# Altium schematic sheet PWR.SchDoc
size A4
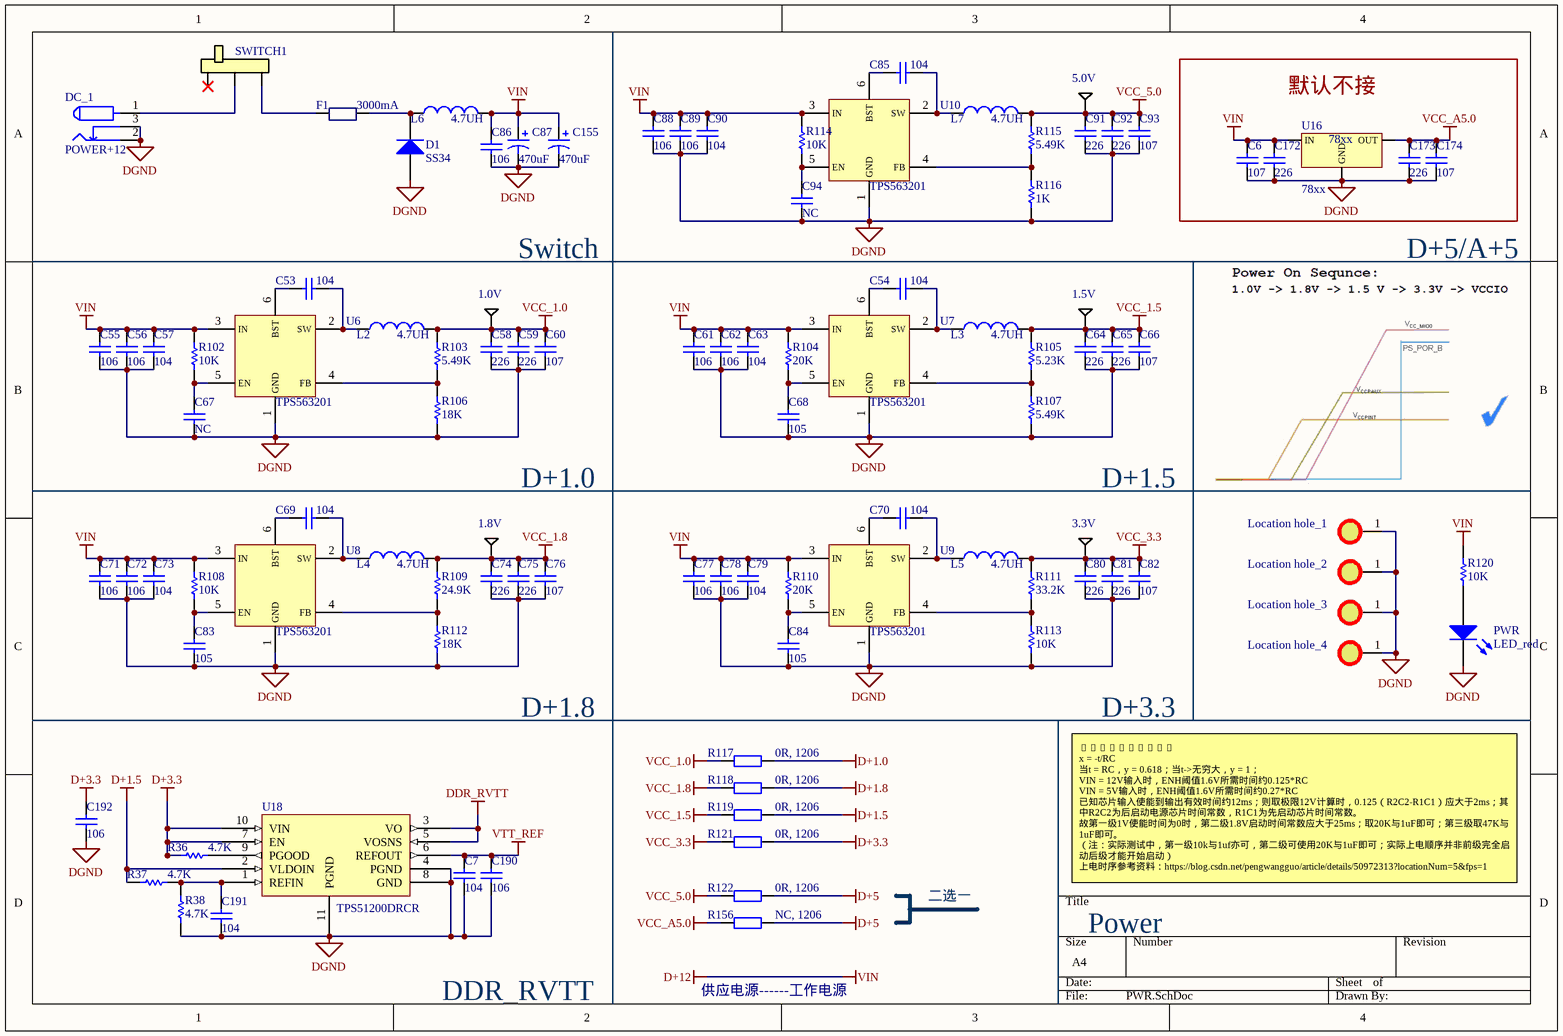
[diagram p0: PWR.SchDoc]

## Parts
1.0V  Test  [Test Point]  (value not drawn)
1.5V  Test  [Test Point]  (value not drawn)
1.8V  Test  [Test Point]  (value not drawn)
3.3V  Test  [Test Point]  (value not drawn)
5.0V  Test  [Test Point]  (value not drawn)
C6  107  [C 1206_L]
C7  104  [C 0402_LL]
C53  104  [C 0402_LL]
C54  104  [C 0402_LL]
C55  106  [C 0805_L]
C56  106  [C 0805_L]
C57  104  [C 0402_LL]
C58  226  [C 0805_L]
C59  226  [C 0805_L]
C60  107  [C 1206_L]
C61  106  [C 0805_L]
C62  106  [C 0805_L]
C63  104  [C 0402_LL]
C64  226  [C 0805_L]
C65  226  [C 0805_L]
C66  107  [C 1206_L]
C67  NC  [C 0402_LL]
C68  105  [C 0402_LL]
C69  104  [C 0402_LL]
C70  104  [C 0402_LL]
C71  106  [C 0805_L]
C72  106  [C 0805_L]
C73  104  [C 0402_LL]
C74  226  [C 0805_L]
C75  226  [C 0805_L]
C76  107  [C 1206_L]
C77  106  [C 0805_L]
C78  106  [C 0805_L]
C79  104  [C 0402_LL]
C80  226  [C 0805_L]
C81  226  [C 0805_L]
C82  107  [C 1206_L]
C83  105  [C 0402_LL]
C84  105  [C 0402_LL]
C85  104  [C 0402_LL]
C86  106  [C 0805_L]
C87  value 470uF  [CD D(7343)]  (hidden comment: Cap Pol1)
C88  106  [C 0805_L]
C89  106  [C 0805_L]
C90  104  [C 0402_LL]
C91  226  [C 0805_L]
C92  226  [C 0805_L]
C93  107  [C 1206_L]
C94  NC  [C 0402_LL]
C155  value 470uF  [CD D(7343)]  (hidden comment: Cap Pol1)
C172  226  [C 0805_L]
C173  226  [C 0805_L]
C174  107  [C 1206_L]
C190  106  [C 0603_L]
C191  104  [C 0402_LL]
C192  106  [C 0603_L]
D1  SS34  [SMA]
DC_1  POWER+12  [DC-005]
F1  3000mA  [FU 1812]
L2  value 4.7UH  [NR6045]  (hidden comment: Inductor)
L3  value 4.7UH  [NR6045]  (hidden comment: Inductor)
L4  value 4.7UH  [NR6045]  (hidden comment: Inductor)
L5  value 4.7UH  [NR6045]  (hidden comment: Inductor)
L6  value 4.7UH  [NR6045]  (hidden comment: Inductor)
L7  value 4.7UH  [NR6045]  (hidden comment: Inductor)
Location_hole_1  Touch  [M3x4+6_N]  (value not drawn)
Location_hole_2  Touch  [M3x4+6_N]  (value not drawn)
Location_hole_3  Touch  [M3x4+6_N]  (value not drawn)
Location_hole_4  Touch  [M3x4+6_N]  (value not drawn)
PWR  LED_red  [LED 0603W]
R36  4.7K  [R 0402_L]
R37  4.7K  [R 0402_L]
R38  4.7K  [R 0402_L]
R102  10K  [R 0603_L]
R103  5.49K  [R 0603_L]
R104  20K  [R 0603_L]
R105  5.23K  [R 0603_L]
R106  18K  [R 0603_L]
R107  5.49K  [R 0603_L]
R108  10K  [R 0603_L]
R109  24.9K  [R 0603_L]
R110  20K  [R 0603_L]
R111  33.2K  [R 0603_L]
R112  18K  [R 0603_L]
R113  10K  [R 0603_L]
R114  10K  [R 0603_L]
R115  5.49K  [R 0603_L]
R116  1K  [R 0603_L]
R117  0R, 1206  [R 1206_L]
R118  0R, 1206  [R 1206_L]
R119  0R, 1206  [R 1206_L]
R120  10K  [R 0603_L]
R121  0R, 1206  [R 1206_L]
R122  0R, 1206  [R 1206_L]
R156  NC, 1206  [R 1206_L]
SWITCH1  Switch  [SS-12D10]  (value not drawn)
U6  TPS563201  [SOT23-6N]
U7  TPS563201  [SOT23-6N]
U8  TPS563201  [SOT23-6N]
U9  TPS563201  [SOT23-6N]
U10  TPS563201  [SOT23-6N]
U16  78xx  [TO252]
U18  TPS51200DRCR  [VSON]

## Blocks framed on the sheet
默认不接: C6 C172-C174 U16

## Nets
D+1.0: R117.2
D+1.5: R37.1 R119.2 U18.2(VLDOIN)
D+1.8: R118.2
D+3.3: C192.2 R36.1 R121.2 U18.7(EN) U18.10(VIN)
D+5: R122.2 R156.2
D+12: C6.1 C55.1 C56.1 C57.1 C61.1 C62.1 C63.1 C71.1 C72.1 C73.1 C77.1 C78.1 C79.1 C86.1 C87.1 C88.1 C89.1 C90.1 C155.1 C172.1 L6.2 R102.2 R104.2 R108.2 R110.2 R114.1 R120.2 U6.3(IN) U7.3(IN) U8.3(IN) U9.3(IN) U10.3(IN) U16.1(IN)  [also labelled VIN]
DDR_RVTT: U18.3(VO) U18.5(VOSNS)
DGND: C6.2 C7.1 C55.2 C56.2 C57.2 C58.2 C59.2 C60.2 C61.2 C62.2 C63.2 C64.2 C65.2 C66.2 C67.2 C68.2 C71.2 C72.2 C73.2 C74.2 C75.2 C76.2 C77.2 C78.2 C79.2 C80.2 C81.2 C82.2 C83.2 C84.2 C86.2 C87.2 C88.2 C89.2 C90.2 C91.2 C92.2 C93.2 C94.2 C155.2 C172.2 C173.2 C174.2 C190.1 C191.1 C192.1 D1.1(A) DC_1.2 DC_1.3 Location_hole_1.1 Location_hole_2.1 Location_hole_3.1 Location_hole_4.1 PWR.2(K) R38.1 R106.1 R107.1 R112.1 R113.1 R116.1 U6.1(GND) U7.1(GND) U8.1(GND) U9.1(GND) U10.1(GND) U16.2(GND) U18.4(PGND) U18.8(GND) U18.11(PGND)
VCC_1.0: 1.0V.1(Test) C58.1 C59.1 C60.1 L2.2 R103.2 R117.1
VCC_1.5: 1.5V.1(Test) C64.1 C65.1 C66.1 L3.2 R105.2 R119.1
VCC_1.8: 1.8V.1(Test) C74.1 C75.1 C76.1 L4.2 R109.2 R118.1
VCC_3.3: 3.3V.1(Test) C80.1 C81.1 C82.1 L5.2 R111.2 R121.1
VCC_5.0: 5.0V.1(Test) C91.1 C92.1 C93.1 L7.2 R115.2 R122.1
VCC_A5.0: C173.1 C174.1 R156.1 U16.3(OUT)
VTT_REF: C7.2 C190.2 U18.6(REFOUT)
NetC53_1: C53.1 L2.1 U6.2(SW)
NetC53_2: C53.2 U6.6(BST)
NetC54_1: C54.1 L3.1 U7.2(SW)
NetC54_2: C54.2 U7.6(BST)
NetC67_1: C67.1 R102.1 U6.5(EN)
NetC68_1: C68.1 R104.1 U7.5(EN)
NetC69_1: C69.1 L4.1 U8.2(SW)
NetC69_2: C69.2 U8.6(BST)
NetC70_1: C70.1 L5.1 U9.2(SW)
NetC70_2: C70.2 U9.6(BST)
NetC83_1: C83.1 R108.1 U8.5(EN)
NetC84_1: C84.1 R110.1 U9.5(EN)
NetC85_1: C85.1 L7.1 U10.2(SW)
NetC85_2: C85.2 U10.6(BST)
NetC94_1: C94.1 R114.2 U10.5(EN)
NetC191_2: C191.2 R37.2 R38.2 U18.1(REFIN)
NetD1_2: D1.2(K) F1.1 L6.1
NetDC_1_1: DC_1.1 SWITCH1.2
NetF1_2: F1.2 SWITCH1.3
NetPWR_1: PWR.1(A) R120.1
NetR36_2: R36.2 U18.9(PGOOD)
NetR103_1: R103.1 R106.2 U6.4(FB)
NetR105_1: R105.1 R107.2 U7.4(FB)
NetR109_1: R109.1 R112.2 U8.4(FB)
NetR111_1: R111.1 R113.2 U9.4(FB)
NetR115_1: R115.1 R116.2 U10.4(FB)

Not connected (* = marked no-connect by the designer): SWITCH1 1*

## Notes on the sheet
- Switch
- D+5/A+5
- D+1.0
- D+1.5
- D+1.8
- D+3.3
- Vref = 0.768V
  1.0V : (R1+Rf)/Rf = 1.309(5.49K; 18K)
  1.5V : (R1+Rf)/Rf = 1.953(5.23K; 5.49K)
  1.8V : (R1+Rf)/Rf = 2.37(24.9K; 18K)
  3.3V : (R1+Rf)/Rf = 4.32(33.2K; 10K)
- 二选一
- 𝑦=1−𝑒^(−𝑥)
  x = -t/RC
  当t = RC，y = 0.618；当t->无穷大，y = 1；
  VIN = 12V输入时，ENH阈值1.6V所需时间约0.125*RC
  VIN = 5V输入时，ENH阈值1.6V所需时间约0.27*RC
  已知芯片输入使能到输出有效时间约12ms；则取极限12V计算时，0.125（R2C2-R1C1）应大于2ms；其中R2C2为后启动电源芯片时间常数，R1C1为先启动芯片时间常数。
  故第一级1V使能时间为0时，第二级1.8V启动时间常数应大于25ms；取20K与1uF即可；第三级取47K与1uF即可。
  （注：实际测试中，第一级10k与1uf亦可，第二级可使用20K与1uF即可；实际上电顺序并非前级完全启动后级才能开始启动）
  上电时序参考资料：https://blog.csdn.net/pengwangguo/article/details/50972313?locationNum=5&fps=1
- Power
- DDR_RVTT
- 供应电源------工作电源

## Library data of the parts
1.0V 1.5V 1.8V 3.3V 5.0V = Test: Test Point
C6 C7 C53-C86 C88-C94 C172-C174 C190-C192 = Cap: Capacitor; Published: 8-Jun-2000; LatestRevisionDate: 17-Jul-2002; LatestRevisionNote: Re-released for DXP Platform.; PackageReference: RAD-0.3; Publisher: Altium Limited; PackageDescription: Radial Cap, Thru-Hole; 2 Leads; 0.3 in Pin Spacing
C87 C155 = Cap Pol1: Polarized Capacitor (Radial); Published: 8-Jun-2000; LatestRevisionDate: 17-Jul-2002; LatestRevisionNote: Re-released for DXP Platform.; PackageReference: RB7.6-15; Publisher: Altium Limited; PackageDescription: Polarized Capacitor (Radial); 2 Leads
D1 = Diode: Default Diode; Published: 8-Jun-2000; LatestRevisionDate: 17-Jul-2002; LatestRevisionNote: Re-released for DXP Platform.; PackageVersion: Sep-1996; PackageReference: SMC; Publisher: Altium Limited; PackageDescription: DO-214-AB/SMC; 2 C-Bend Leads; Body 7.9 x 5.9 mm, inc. leads (LxW); Code_JEDEC: DO-214-AB
DC_1 = POWER
F1 = PTC
L2-L7 = Inductor: Code_IEC: 1005; Published: 8-Jun-2000; LatestRevisionDate: 29-May-2009; LatestRevisionNote: IPC-7351 Footprint Added.; PackageReference: 0402-A; Publisher: Altium Limited; PackageDescription: Chip Inductor; Code_JEITA: 0402
PWR = LED0: Typical INFRARED GaAs LED; Published: 8-Jun-2000; LatestRevisionDate: 08-Jul-2005; LatestRevisionNote: Mech Layer 1 removed.; PackageReference: LED-0; Publisher: Altium Limited; PackageDescription: LED; 2 Leads
R36-R38 R102-R115 R120 = Res1: Resistor; Value: 1K; Published: 8-Jun-2000; LatestRevisionDate: 17-Jul-2002; LatestRevisionNote: Re-released for DXP Platform.; PackageReference: AXIAL-0.3; Publisher: Altium Limited; PackageDescription: Axial Device, Thru-Hole; 2 Leads; 0.3 in Pin Spacing
R116 = Res1: Resistor; Published: 8-Jun-2000; LatestRevisionDate: 17-Jul-2002; LatestRevisionNote: Re-released for DXP Platform.; PackageReference: AXIAL-0.3; Publisher: Altium Limited; PackageDescription: Axial Device, Thru-Hole; 2 Leads; 0.3 in Pin Spacing; Value: 1K
R117-R119 R121 R122 R156 = Res2: Resistor; Value: RES; Published: 8-Jun-2000; LatestRevisionDate: 17-Jul-2002; LatestRevisionNote: Re-released for DXP Platform.; PackageReference: AXIAL-0.4; Publisher: Altium Limited; PackageDescription: Axial Device, Thru-Hole; 2 Leads; 0.4 in Pin Spacing
U6-U10 = TPS563201: TPS563201, BUCK, 3A
U18 = TPS51200: DDR 终端稳压器; Manufacturer: TI; value: NC